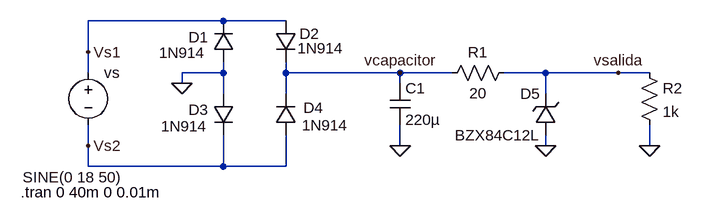
[diagram p0: schematic Draft15.asc]
Draft15.asc, the LTspice schematic file:
Version 4
SHEET 1 880 680
WIRE 160 48 -48 48
WIRE 256 48 160 48
WIRE -48 96 -48 48
WIRE -48 128 -48 96
WIRE 160 128 160 112
WIRE 160 128 96 128
WIRE 256 128 256 112
WIRE 432 128 256 128
WIRE 512 128 432 128
WIRE 656 128 592 128
WIRE 768 128 656 128
WIRE 816 128 768 128
WIRE 96 144 96 128
WIRE 432 144 432 128
WIRE 160 160 160 128
WIRE 256 160 256 128
WIRE 656 160 656 128
WIRE -48 240 -48 208
WIRE 432 240 432 208
WIRE 656 240 656 224
WIRE 816 240 816 208
WIRE -48 272 -48 240
WIRE 160 272 160 224
WIRE 160 272 -48 272
WIRE 256 272 256 224
WIRE 256 272 160 272
FLAG 96 144 0
FLAG 816 240 0
FLAG -48 96 Vs1
FLAG -48 240 Vs2
FLAG 432 240 0
FLAG 432 128 vcapacitor
FLAG 768 128 vsalida
FLAG 656 240 0
SYMBOL voltage -48 112 R0
WINDOW 3 -101 177 Left 2
WINDOW 123 0 0 Left 0
WINDOW 39 0 0 Left 0
SYMATTR Value SINE(0 18 50)
SYMATTR InstName vs
SYMBOL diode 176 112 R180
WINDOW 0 39 39 Left 2
WINDOW 3 44 15 Left 2
SYMATTR InstName D1
SYMATTR Value 1N914
SYMBOL diode 240 48 R0
WINDOW 0 37 20 Left 2
WINDOW 3 34 42 Left 2
SYMATTR InstName D2
SYMATTR Value 1N914
SYMBOL diode 144 160 R0
WINDOW 0 -38 25 Left 2
WINDOW 3 -80 50 Left 2
SYMATTR InstName D3
SYMATTR Value 1N914
SYMBOL diode 272 224 R180
WINDOW 0 -42 42 Left 2
WINDOW 3 -80 15 Left 2
SYMATTR InstName D4
SYMATTR Value 1N914
SYMBOL res 800 112 R0
SYMATTR InstName R2
SYMATTR Value 1k
SYMBOL cap 416 144 R0
SYMATTR InstName C1
SYMATTR Value 220µ
SYMBOL res 608 112 R90
WINDOW 0 0 56 VBottom 2
WINDOW 3 32 56 VTop 2
SYMATTR InstName R1
SYMATTR Value 20
SYMBOL zener 672 224 R180
WINDOW 0 24 64 Left 2
WINDOW 3 24 0 Left 2
SYMATTR InstName D5
SYMATTR Value BZX84C12L
SYMATTR Description Diode
SYMATTR Type diode
TEXT -152 312 Left 2 !.tran 0 40m 0 0.01m

The netlist it stands for:
* Draft15.asc
vs Vs1 Vs2 SINE(0 18 50)
D1 0 Vs1 1N914
D2 Vs1 vcapacitor 1N914
D3 0 Vs2 1N914
D4 Vs2 vcapacitor 1N914
R2 vsalida 0 1k
C1 vcapacitor 0 220µ
R1 vsalida vcapacitor 20
D5 0 vsalida BZX84C12L
.model D D
.lib standard.dio
.tran 0 40m 0 0.01m
.backanno
.end